# EAGLE design MINI_SAM_TQFP_2.54_BB_2017_01_12_001 (EAGLE 7.6.0)
DESIGNER: BENJAMIN SHOCKLEY; REV: A
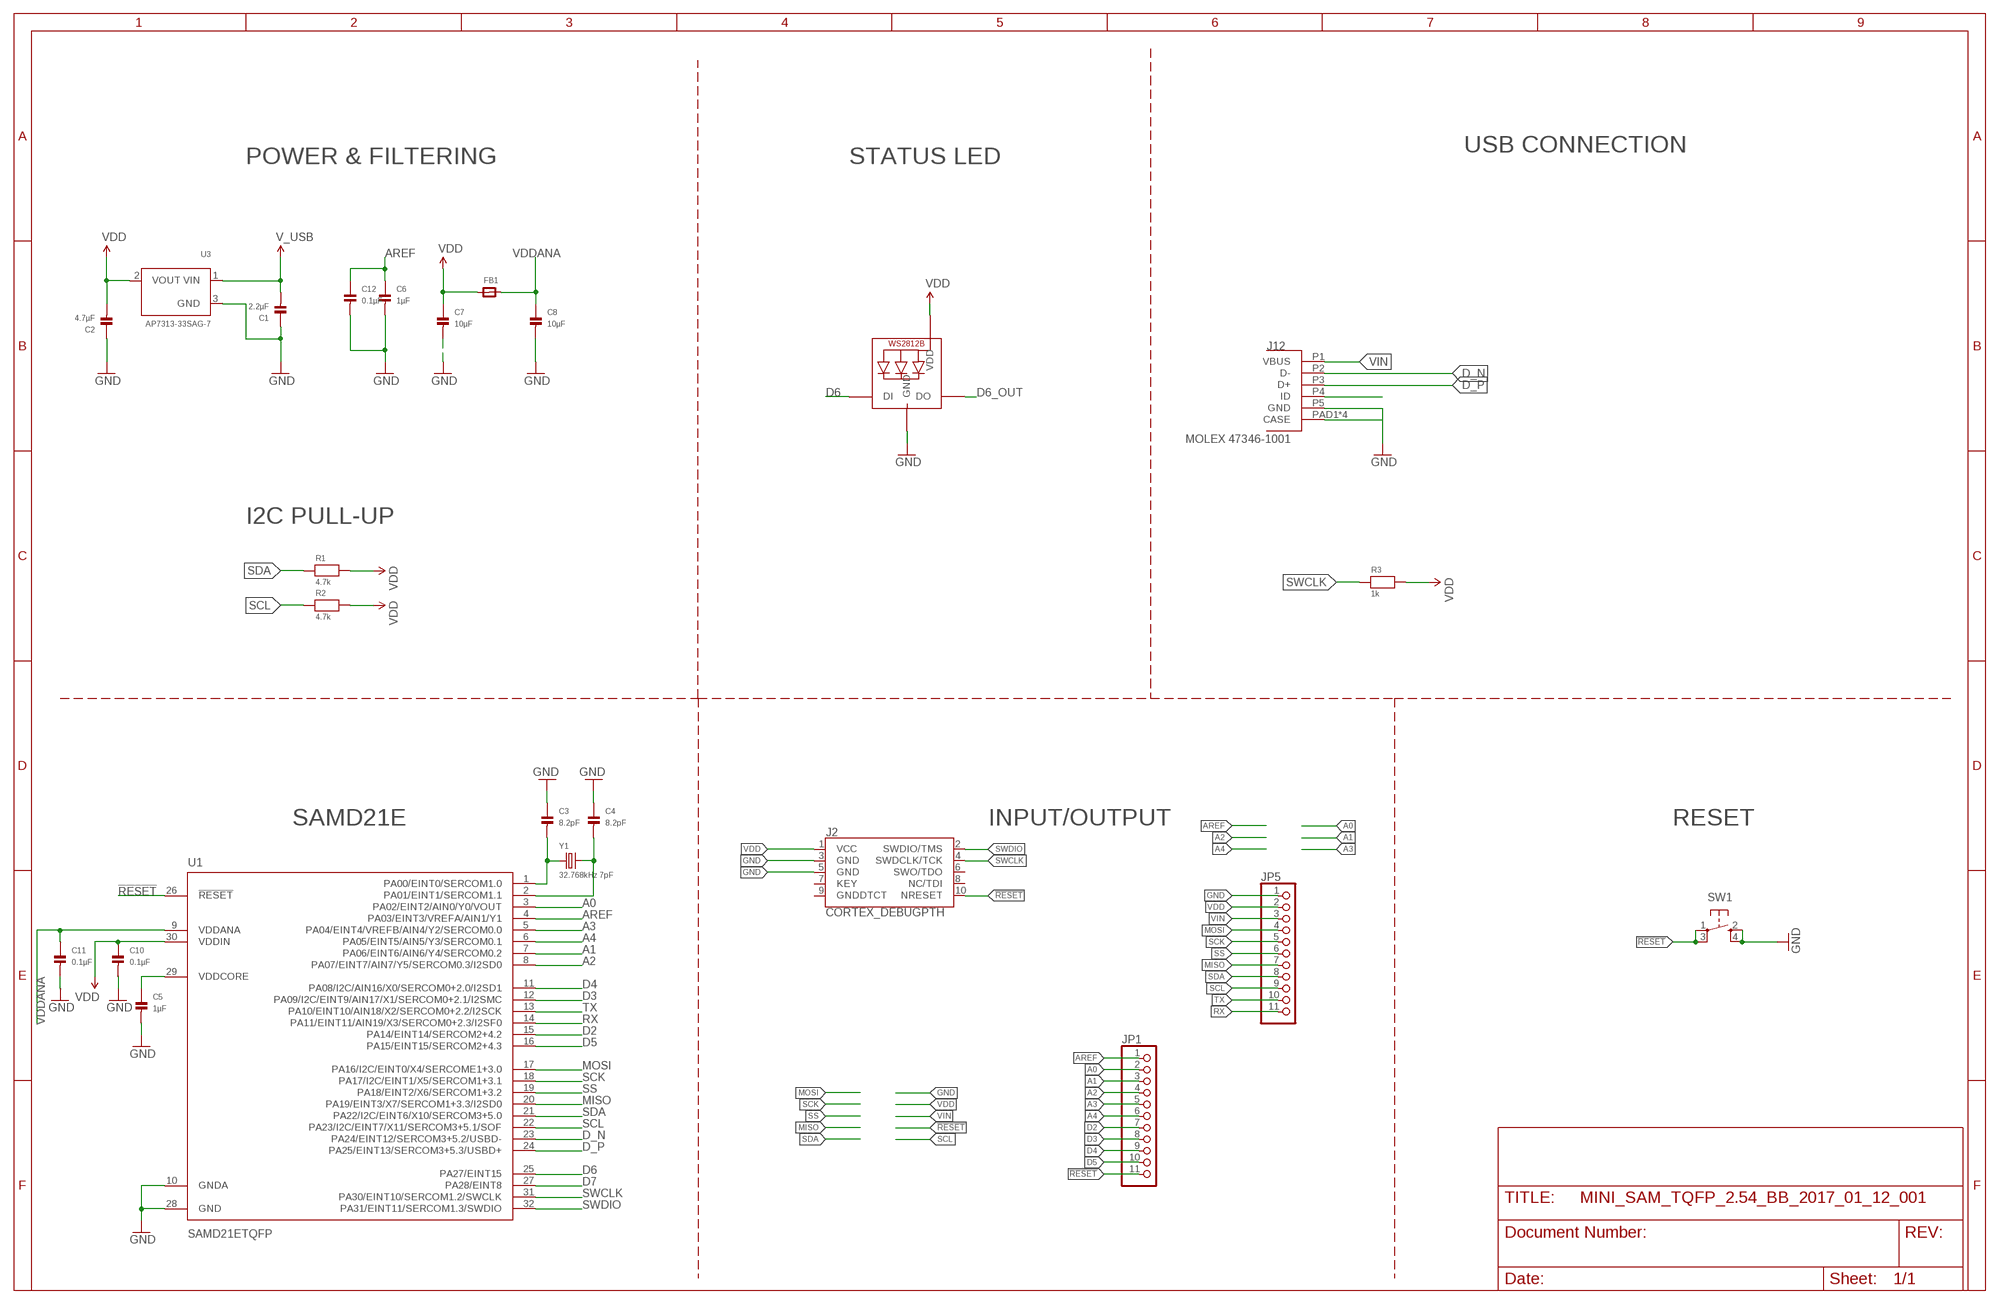
[diagram p0: schematic, sheet 1]

## Parts
C1  2.2µF  CAP_CERAMIC_0805MP  [_0805MP]
C2  4.7µF  CAP_CERAMIC_0805MP  [_0805MP]
C3  8.2pF  CAP_CERAMIC_0805MP  [_0805MP]
C4  8.2pF  CAP_CERAMIC_0805MP  [_0805MP]
C5  1µF  CAP_CERAMIC_0805MP  [_0805MP]
C6  1µF  CAP_CERAMIC_0805MP  [_0805MP]
C7  10µF  CAP_CERAMIC_0805MP  [_0805MP]
C8  10µF  CAP_CERAMIC_0805MP  [_0805MP]
C10  0.1µF  CAP_CERAMIC_0805MP  [_0805MP]
C11  0.1µF  CAP_CERAMIC_0805MP  [_0805MP]
C12  0.1µF  CAP_CERAMIC_0805MP  [_0805MP]
FB1  FERRITE_0805MP  [_0805MP]
J2  CORTEX_DEBUGPTH  [2X5-PTH-1.27MM]
J12  MOLEX_47346-100147346  [MOLEX_47346-1001]
JP1  PINHD-1X111X11_SMT  [1X11_SMT]
JP5  PINHD-1X111X11_SMT  [1X11_SMT]
R1  4.7k  RESISTOR_0805MP  [_0805MP]
R2  4.7k  RESISTOR_0805MP  [_0805MP]
R3  1k  RESISTOR_0805MP  [_0805MP]
STATUS  WS2812B3535  [LED3535]
SW1  SPST_TACT-KMR2  [KMR2]
U1  SAMD21ETQFP  [TQFP32-08]
U3  AP7313-33SAG-7  VREG_SOT23  [SOT23-R]
Y1  32.768kHz 7pF  CRYSTAL0805PACKAGE  [_0805MP]

## Nets
!RESET: J2.10(NRESET) JP1.11 SW1.1(P) SW1.3(P1) U1.26(!RESET)
A0: JP1.2 U1.3(PA02/EINT2/AIN0/Y0/VOUT)
A1: JP1.3 U1.7(PA06/EINT6/AIN6/Y4/SERCOM0.2)
A2: JP1.4 U1.8(PA07/EINT7/AIN7/Y5/SERCOM0.3/I2SD0)
A3: JP1.5 U1.5(PA04/EINT4/VREFB/AIN4/Y2/SERCOM0.0)
A4: JP1.6 U1.6(PA05/EINT5/AIN5/Y3/SERCOM0.1)
AREF: C6.1 C12.1 JP1.1 U1.4(PA03/EINT3/VREFA/AIN1/Y1)
D2: JP1.7 U1.15(PA14/EINT14/SERCOM2+4.2)
D3: JP1.8 U1.12(PA09/I2C/EINT9/AIN17/X1/SERCOM0+2.1/I2SMC)
D4: JP1.9 U1.11(PA08/I2C/AIN16/X0/SERCOM0+2.0/I2SD1)
D5: JP1.10 U1.16(PA15/EINT15/SERCOM2+4.3)
D6: STATUS.1(DI) U1.25(PA27/EINT15)
D6_OUT: STATUS.3(DO)
D7: U1.27(PA28/EINT8)
D_N [USB_DATA]: J12.P2(D-) U1.23(PA24/EINT12/SERCOM3+5.2/USBD-)
D_P [USB_DATA]: J12.P3(D+) U1.24(PA25/EINT13/SERCOM3+5.3/USBD+)
GND: C1.1 C2.1 C3.1 C4.1 C5.2 C6.2 C7.2 C8.2 C10.2 C11.2 C12.2 J2.3(GND) J2.5(GND) J12.P5(GND) J12.PAD1(CASE) J12.PAD2(CASE) J12.PAD3(CASE) J12.PAD4(CASE) JP5.1 STATUS.4(GND) SW1.2(S) SW1.4(S1) U1.10(GNDA) U1.28(GND) U3.3(GND)
MISO: JP5.7 U1.20(PA19/EINT3/X7/SERCOM1+3.3/I2SD0)
MOSI: JP5.4 U1.17(PA16/I2C/EINT0/X4/SERCOME1+3.0)
N$1: C3.2 U1.1(PA00/EINT0/SERCOM1.0) Y1.1
N$5: C4.2 U1.2(PA01/EINT1/SERCOM1.1) Y1.2
N$9: C5.1 U1.29(VDDCORE)
N$10: J12.P4(ID)
RX: JP5.11 U1.14(PA11/EINT11/AIN19/X3/SERCOM0+2.3/I2SF0)
SCK: JP5.5 U1.18(PA17/I2C/EINT1/X5/SERCOM1+3.1)
SCL: JP5.9 R2.1 U1.22(PA23/I2C/EINT7/X11/SERCOM3+5.1/SOF)
SDA: JP5.8 R1.1 U1.21(PA22/I2C/EINT6/X10/SERCOM3+5.0)
SS: JP5.6 U1.19(PA18/EINT2/X6/SERCOM1+3.2)
SWCLK: J2.4(SWDCLK/TCK) R3.1 U1.31(PA30/EINT10/SERCOM1.2/SWCLK)
SWDIO: J2.2(SWDIO/TMS) U1.32(PA31/EINT11/SERCOM1.3/SWDIO)
TX: JP5.10 U1.13(PA10/EINT10/AIN18/X2/SERCOM0+2.2/I2SCK)
VDD: C2.2 C7.1 C10.1 FB1.1 J2.1(VCC) JP5.2 R1.2 R2.2 R3.2 STATUS.2(VDD) U1.30(VDDIN) U3.2(VOUT)
VDDANA: C8.1 C11.1 FB1.2 U1.9(VDDANA)
VIN: C1.2 J12.P1(VBUS) JP5.3 U3.1(VIN) ; supply symbol labelled V_USB
Unconnected: J2.6(SWO/TDO) J2.7(KEY) J2.8(NC/TDI) J2.9(GNDDTCT)

## Notes on the sheet
- USB CONNECTION
- POWER & FILTERING | STATUS LED
- MOLEX 47346-1001
- I2C PULL-UP
- SAMD21E | INPUT/OUTPUT | RESET

## Library data of the parts
C1-C8 C10-C12 = microbuilder:CAP_CERAMIC: Ceramic Capacitors 0402 - 0402 Surface Mount Capacitors 16pF 50V 5% [Digikey: 445-4899-2-ND] 18pF 50V 5% [Digikey: 490-1281-2-ND] 22pF 50V 5% [Digikey: 490-1283-2-ND] 68pF 50V 5% [Digikey: 490-1289-2-ND] 0.1uF 10V 10% [Digikey: 490-1318-2-ND] 1.0uF 6.3V 10% [Digikey: 490-1320-2-ND] 0603 - 0603 Surface Mount Capacitors 16 pF 50V 5% [Digikey: 445-5051-2-ND] 22 pF 50V [Digikey: PCC220ACVTR-ND] 33 pF 50V 5% [Digikey: 490-1415-1-ND] 56pF 50V 5% [Digikey: 490-1421-1-ND] 220pF 50V 5% [Digikey: 445-1285-1-ND] 680 pF 50V 2200 pF 50V 5% C0G [Digikey: 445-1297-1-ND] 5600 pF 100V 5% X7R [Digikey: 478-3711-1-ND] 0.1 µF 25V 10% [Digikey: PCC2277TR-ND] 0.22 µF 16V 10% X7R [Digikey: 445-1318-1-ND] 1.0 µF 25V 10% [Digikey: 445-5146-2-ND] 0603 - RF Specific 3pF 250V +/-0.1pF RF [Digikey: 712-1347-1-ND] 18 pF 250V 5% [Digikey: 478-3505-1-ND or 712-1322-1-ND] 56 pF 250V 5% C0G RF [Digikey: 490-4867-1-ND] 68 pF 250V RF [Digikey: 490-4868-1-ND] 0805 - 0805 Surface Mount Capacitors 220 pF 250V 2% RF Ceramic Capacitor [Digikey: 712-1398-1-ND] 1000 pF 50V 2% NP0 Ceramic Capacitor [Digikey: 478-3760-1-ND] 0.1 µF 25V 10% Ceramic Capacitor [Digikey: PCC1828TR-ND] 1.0 µF 16V 10% Ceramic Capacitor[Digikey: 490-1691-2-ND] 10.0 µF 10V 10% Ceramic Capacitor[Digikey: 709-1228-1-ND] 10.0 uF 16V 10% Ceramic Capacitor [Digikey: 478-5165-2-ND] 47 uF 6.3V 20% Ceramic Capacitor [Digikey: 587-1779-1-ND or 399-5506-1-ND] 1206 - 1206 Surface Mount Capacitors 47uF 10V 20% Ceramic Capacitor [Digikey: 490-5528-1-ND or 399-5508-1-ND or 445-6010-1-ND] 100uF 6.3V -20%, +80% Y5V Ceramic Capacitor (Digikey: 490-4512-1-ND, Mouser: 81-GRM31CF50J107ZE1L)
FB1 = microbuilder:FERRITE: Ferrite Bead 0603 MMZ1608B121C - 120 Ohm @ 100MHz, 600mA, 0.15 Ohm DC Resistance - Digikey: 445-2164-1-ND BK1608HW121-T - 120 Ohm, 600mA Ferrite Chip - Digikey: 587-1876-2-ND 0805 HZ0805B272R-10 - 2.7K Ohm @ 100MHz, 200mA, 0.8 Ohm DC Resistance - Digikey: 240-2504-1-ND (see also Murata BLM21BD272SN1L) MMZ2012Y152B - 1.5K Ohm @ 100MHz, 500mA, 0.4 Ohm DC Resistance - Digikey: 445-1560-1-ND - Mainly for high frequency (80-400MHz) MMZ2012R102A - 1K Ohm @ 100MHz, 500mA, 0.3 Ohm DC Resistance - Digikey: 445-1555-2-ND - More general purpose (10-200MHz)
J2 = SparkFun-Connectors:CORTEX_DEBUG: Cortex Debug Connector Datasheet <http://infocenter.arm.com/help/topic/com.arm.doc.faqs/attached/13634/cortex_debug_connectors.pdf>
J12 = Shockley_Custom:MOLEX_47346-1001
JP1 JP5 = pinhead+:PINHD-1X11: PIN HEADER
R1-R3 = microbuilder:RESISTOR: Resistors 0402 - 0402 Surface Mount Package 22 Ohm 1% 1/16W [Digikey: 311-22.0LRTR-ND] 33 Ohm 5% 1/16W 1.0K 5% 1/16W 1.5K 5% 1/16W 2.0K 1% 1/16W 10.0K 1% 1/16W [Digikey: 311-10.0KLRTR-ND] 10.0K 5% 1/16W [Digikey: RMCF0402JT10K0TR-ND] 12.1K 1% 1/16W [Digikey: 311-22.0LRTR-ND] 100.0K 5% 1/16W 0603 - 0603 Surface Mount Package 0 Ohm 1/10 Watt 1% Resistor 15 Ohm 1/10 Watt 1% Resistor 33 Ohm 1/10 Watt 1% Resistor 49.9 Ohm 1/10 Watt 1% Resistor 100 Ohm 1/10 Watt 1% Resistor 150 Ohm 1/10 Watt 1% Resistor 240 Ohm 1/10 Watt 1% Resistor 390 Ohm 1/10 Watt 1% Resistor 560 Ohm 1/10 Watt 1% Resistor 680 Ohm 1/10 Watt 1% Resistor 750 Ohm 1/10 Watt 1% Resistor 1.0K Ohm 1/10 Watt 1% Resistor 1.5K Ohm 1/10 Watt 1% Resistor 2.0K Ohm 1/10 Watt 1% Resistor 2.2K Ohm 1/10 Watt 1% Resistor 3.3K Ohm 1/10 Watt 1% Resistor 4.7K Ohm 1/10 Watt 1% Resistor 10.0K Ohm 1/10 Watt 1% Resistor 12.0K Ohm 1/10 Watt 1% Resistor 12.1K Ohm 1/10 Watt 1% Resistor 20.0K Ohm 1/10 Watt 1% Resistor 33.0K Ohm 1/10 Watt 1% Resistor 100.0K Ohm 1/10 Watt 1% Resistor 0805 - 0805 Surface Mount Package 0 Ohm 1/8 Watt 1% Resistor 33 Ohm 1/8 Watt 1% Resistor 100 Ohm 1/8 Watt 1% Resistor 150 Ohm 1/8 Watt 1% Resistor 200 Ohm 1/8 Watt 1% Resistor 240 Ohm 1/8 Watt 1% Resistor 330 Ohm 1/8 Watt 1% Resistor 390 Ohm 1/8 Watt 1% Resistor 470 Ohm 1/8 Watt 1% Resistor 1.0K Ohm 1/8 Watt 1% Resistor 1.5K Ohm 1/8 Watt 1% Resistor 2.0K Ohm 1/8 Watt 1% Resistor 4.7K Ohm 1/8 Watt 1% Resistor 5.1K Ohm 1/8 Watt 1% Resistor 5.6K Ohm 1/8 Watt 1% Resistor 10.0K Ohm 1/8 Watt 1% Resistor 22.0K Ohm 1/8 Watt 1% Resistor 33.0K Ohm 1/8 Watt 1% Resistor 100K Ohm 1/8 Watt 1% Resistor 1206 - 1206 Surface Mount Package 2012 - 2010 Surface Mount Package 0.11 Ohm 1/2 Watt 1% Resistor - Digikey: RHM.11UCT-ND
STATUS = adafruit:WS2812B
SW1 = adafruit:SPST_TACT: SMT 6mm switch, EVQQ2 series http://www.ladyada.net/library/eagle
U1 = Shockley_Custom:SAMD21E
U3 = microbuilder:VREG_SOT23: SOT23 Fixed Voltage Regulators Part Current Out V Out V In V Dropout Digikey Part No. AP7313 150mA 3.3V 3.5-6V 0.15V @ 150mA AP7313-33SAG-7DICT-ND
Y1 = Shockley_Custom:CRYSTAL: Crystals HC49UP - Surface Mount Crystal 4.0MHz 18pF +/-30ppm Surface Mount Crystal [Digikey: 535-9857-1-ND] 12.0 MHz Surface Mount Crystal [Digikey: 535-9869-6-ND] 25.0 MHz Surface Mount Crystal [Digikey: 535-9078-1-ND] 2.5 x 2.0mm - MEMs SMT Crystal 16.0 MHz 10pF 20ppm 2.5 x 2.0mm Crystal [Digikey -40-85°C: 535-10923-1-ND] 3.2 x 2.5mm - MEMs SMT Crystal 12.0 MHz 8pF 15ppm 3.2 x 2.5mm Crystal [Digikey: -10-70°C: 644-1047-1-ND -40-125°C: 644-1128-1-ND] 16.0 MHz 8pF 15ppm 3.2 x 2.5mm Crystal [Digikey: -10-70°C: 644-1049-1-ND -40-125°C: 644-1129-2-ND] 16.0 MHz 10pF 10ppm 3.2 x 2.5mm Crystal [Digikey: 644-1100-1-ND] 27.12 MHz 18pF 30ppm 3.2 x 2.5mm Crystal [Digikey: 887-1424-1-ND] 27.12MHz 10pF 10ppm 3.2 x 2.5mm Crystal [Digikey: 887-1329-1-ND] 4.9 x 1.8mm - MEMs SMT Crystal 32.768 KHz 12.5pF 20ppm 4.9 x 1.8mm Crystal [Digikey: SE2415CT-ND] 8.0 x 3.8mm - Surface Mount Crystal 32.768kHz 12.5pF 20ppm -40°C-85°C [Digikey: 535-9166-2-ND] Cylinder 32.768KHz Cylinder Crystal (2x6mm body) [Ex. Digikey: 300-8341-2-ND]

## Board
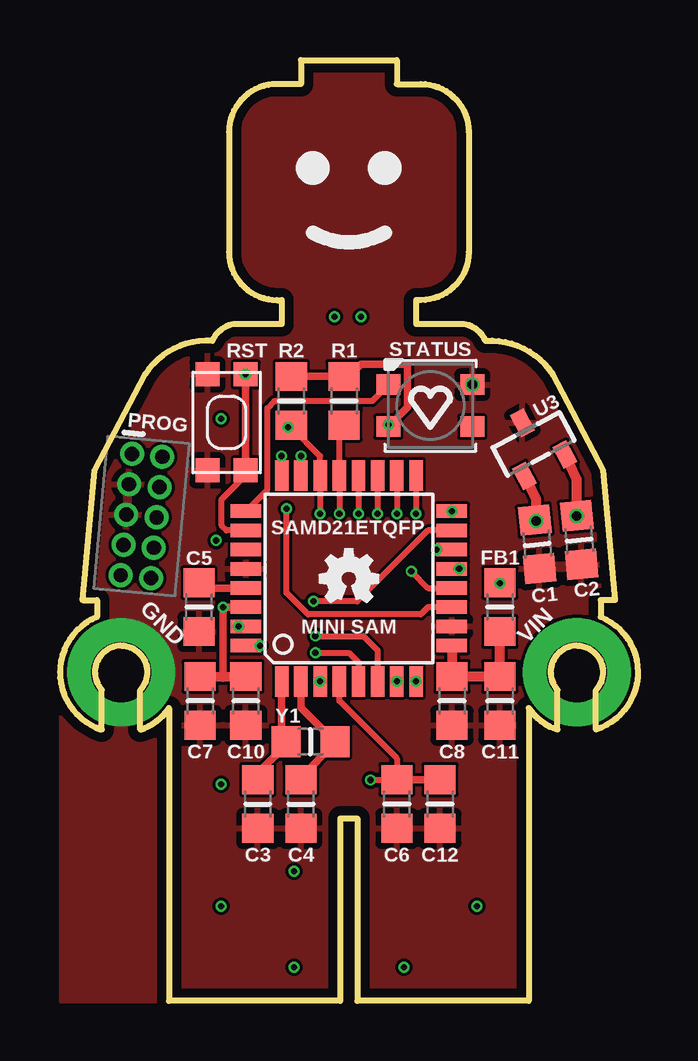
[diagram p1: board, top side]
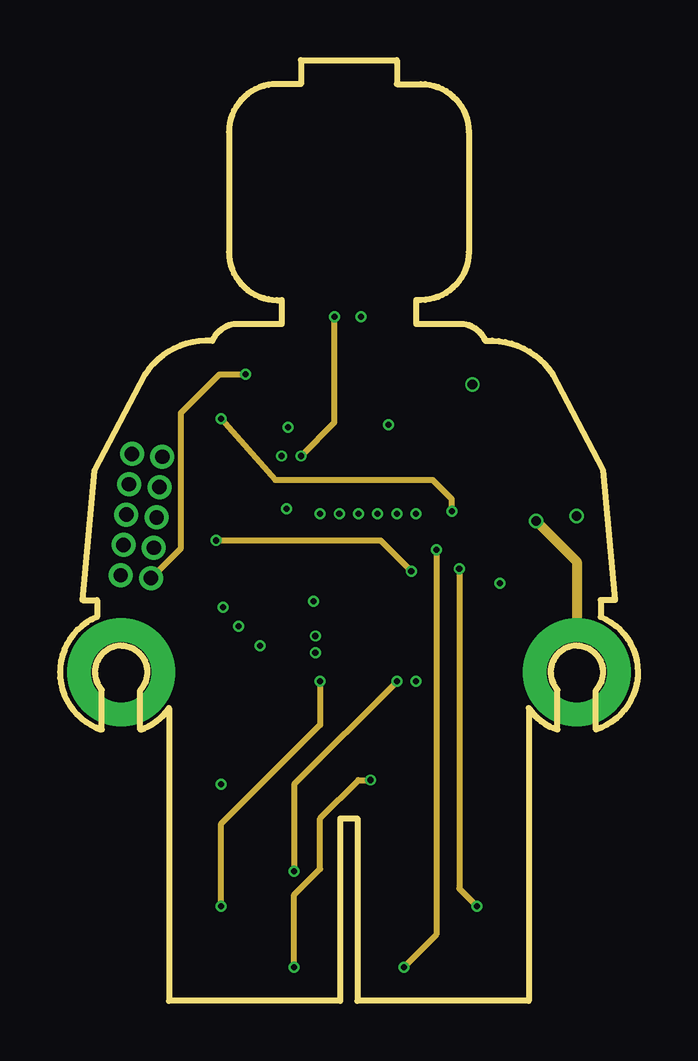
[diagram p2: board, inner layer Route2]
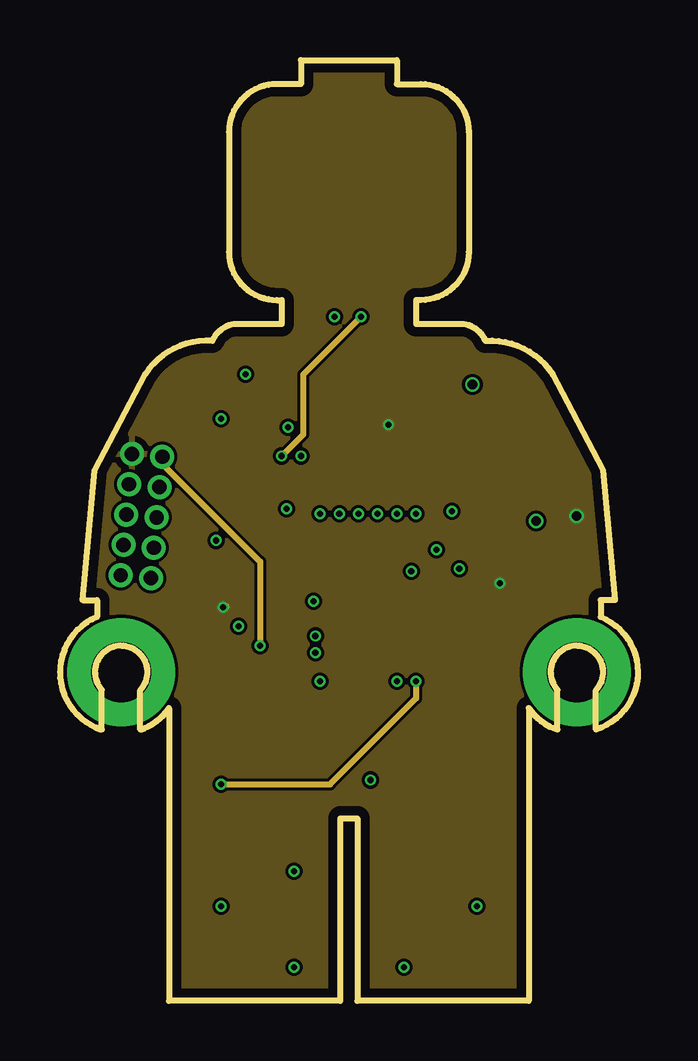
[diagram p3: board, inner layer Route15]
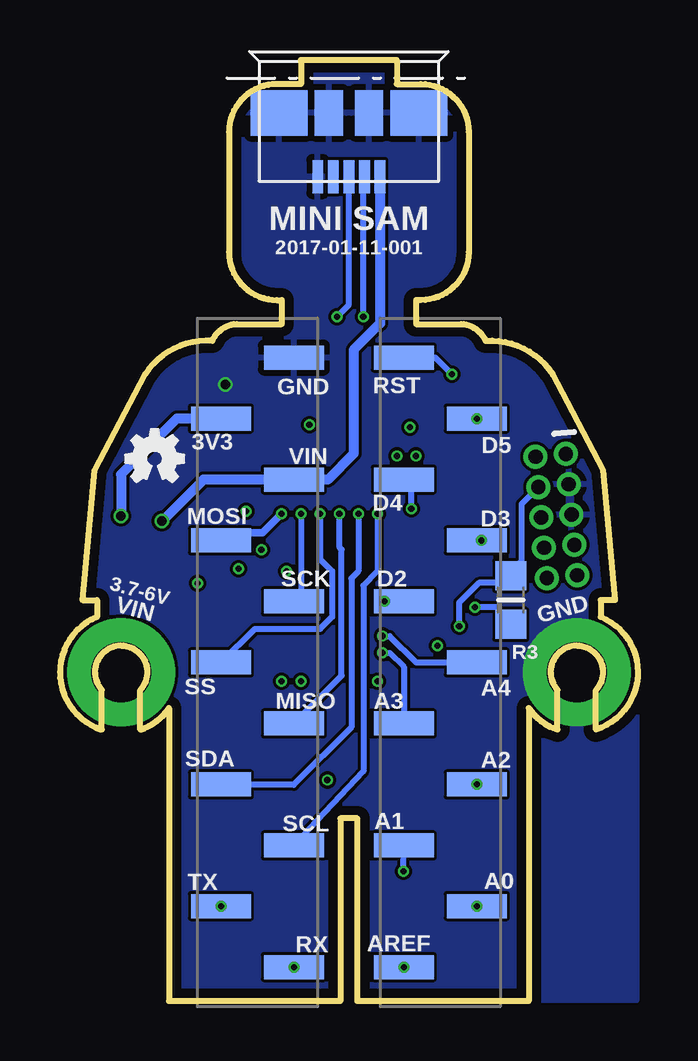
[diagram p4: board, bottom side, seen from below]

Size 24.1 x 39.2 mm. Coordinates in mm from the lower left corner, seen from the top.
Outline: 4.55,12.2 4.55,0 11.7,0 11.7,7.6 12.4,7.6 12.4,0 19.55,0 19.55,12.2
Outline: 4.55,12.2 arc-28 3.65,11.4
Outline: 4.55,12.2 arc-40 3.35,11.3 3.35,12.95 arc132 2.55,14.8 arc132 1.75,12.95 1.75,11.3 arc-140 1.55,16 1.55,16.7 0.95,16.7 1.45,22.1 3.55,26.1 arc-60 6.35,27.5 arc-63 7.37,28.2 9.25,28.2 9.25,29.2 9.05,29.2 arc-90 7.05,31.2 7.05,36.2 arc-90 9.05,38.2 10.05,38.2 10.05,39.2 14.05,39.2 14.05,38.2 15.05,38.2 arc-90 17.05,36.2 17.05,31.2 arc-90 15.05,29.2 14.85,29.2 14.85,28.2 16.73,28.2 arc-63 17.75,27.5 arc-60 20.55,26.1 22.65,22.1 23.15,16.7 22.55,16.7 22.55,16 arc-140 22.35,11.3 22.35,12.95 arc132 21.55,14.8 arc132 20.75,12.95 20.75,11.3 arc-40 19.55,12.2
Outline: 19.55,12.2 arc28 20.45,11.4
Copper layers (1*2*15*16): Top 0.035559375mm / dielectric 0.17018125mm / Route2 0.01778125mm / dielectric 47mil / Route15 0.01778125mm / dielectric 0.17018125mm / Bottom 0.035559375mm
Design rules "OSHPark-4layer *": minimum track width 5mil, minimum drill 10mil, track to track 5mil, track to pad 5mil, pad to pad 5mil, via to via 5mil, smd to smd 5mil, copper to edge 15mil, drill to drill 6mil, minimum pad ring 4mil, minimum via ring 4mil, stop-mask expansion 2.5mil, vias tented up to drill 28mil, thermal gap 10mil

### Footprints (pad centres in the part's own frame; a part is rotated, then mirrored left to right if it is on the bottom)
_0805MP = smd 1.2 x 1.3: 1 -1.016,0; 2 1.016,0
2X5-PTH-1.27MM = drill 0.6 pad 1: 1 -2.54,-0.635; 2 -2.54,0.635; 3 -1.27,-0.635; 4 -1.27,0.635; 5 0,-0.635; 6 0,0.635; 7 1.27,-0.635; 8 1.27,0.635; 9 2.54,-0.635; 10 2.54,0.635
MOLEX_47346-1001 = smd 0.45 x 1.38: P1 1.3,-2.66; P2 0.65,-2.66; P3 0,-2.66; P4 -0.65,-2.66; P5 -1.3,-2.66 | smd 2.375 x 1.9: PAD1 -2.913,0; PAD4 2.913,0 | smd 1.175 x 1.9: PAD2 -0.838,0; PAD3 0.838,0
1X11_SMT = smd 1 x 2.5: 1 -12.7,1.52; 2 -10.16,-1.52; 3 -7.62,1.52; 4 -5.08,-1.52; 5 -2.54,1.52; 6 0,-1.52; 7 2.54,1.52; 8 5.08,-1.52; 9 7.62,1.52; 10 10.16,-1.52; 11 12.7,1.52
LED3535 = smd 1 x 0.85: 1 -1.75,0.875; 2 -1.75,-0.875; 3 1.75,-0.875; 4 1.75,0.875
KMR2 = smd 1 x 1: 1 2,0.8; 2 2,-0.8; 3 -2,0.8; 4 -2,-0.8
TQFP32-08 = smd 1.27 x 0.559: 1 -4.293,2.8; 2 -4.293,2; 3 -4.293,1.2; 4 -4.293,0.4; 5 -4.293,-0.4; 6 -4.293,-1.2; 7 -4.293,-2; 8 -4.293,-2.8; 17 4.293,-2.8; 18 4.293,-2; 19 4.293,-1.2; 20 4.293,-0.4; 21 4.293,0.4; 22 4.293,1.2; 23 4.293,2; 24 4.293,2.8 | smd 0.559 x 1.27: 9 -2.8,-4.293; 10 -2,-4.293; 11 -1.2,-4.293; 12 -0.4,-4.293; 13 0.4,-4.293; 14 1.2,-4.293; 15 2,-4.293; 16 2.8,-4.293; 25 2.8,4.293; 26 2,4.293; 27 1.2,4.293; 28 0.4,4.293; 29 -0.4,4.293; 30 -1.2,4.293; 31 -2,4.293; 32 -2.8,4.293
SOT23-R = smd 0.635 x 1.016: 1 -0.95,-1; 2 0.95,-1; 3 0,1

### Placement (x,y rotation side)
C1  19.9,19.02 95.7 top
C2  21.65,19.2 95.7 top
C3  8.25,8.2 90 top
C4  10.05,8.2 90 top
C5  5.8,16.4 270 top
C6  14.05,8.2 270 top
C7  5.85,12.5 270 top
C8  16.35,12.5 270 top
C10  7.75,12.5 270 top
C11  18.35,12.5 270 top
C12  15.85,8.2 270 top
FB1  18.35,16.4 270 top
J2  3.4,20.2 264.7 top
J12  12.05,37 0 bottom
JP1  8.24,14.1 90 bottom
JP5  15.86,14.1 270 bottom
R1  11.85,25 90 top
R2  9.65,25 90 top
R3  5.3,16.7 270 bottom
STATUS  15.45,24.8 0 top
SW1  6.95,24.1 270 top
U1  12.05,17.6 90 top
U3  19.75,23.2 27.7 top
U$1  [OSHW-LOGO-MINI]  12.05,17.6 0 top
U$2  [OSHW-LOGO-MINI]  20.15,22.6 0 bottom
Y1  10.45,10.8 0 top

### Tracks (layer width: path | path; a pad name or v marks a point on that pad's centre or on a via)
!RESET  (via drill 0.25)
  Top 0.254: U1.26 6.95,19.6 6.75,19.8 6.75,20.9 7.75,21.9 SW1.1
  Top 0.305: SW1.1 SW1.3
  Route2 0.254: J2.10 5.05,18.86 5.05,24.5 6.65,26.1 SW1.3
  Bottom 0.254: 9.35,26.8 JP1.11 8.45,26.8 SW1.3
  other vias: 7.75,26.1
A0  (via drill 0.25)
  Route2 0.254: U1.3 10.85,11.5 6.73,7.38 JP1.2
  other vias: 10.85,13.31 6.72,3.94
A1  (via drill 0.25)
  Route2 0.254: U1.7 9.77,9.02 v9.77,5.4
  Bottom 0.254: v9.77,5.4 JP1.3
  other vias: 14.05,13.31
A2  (via drill 0.25)
  Route15 0.254: U1.8 14.85,12.6 11.27,9.02 JP1.4
  other vias: 14.85,13.31 6.72,9.02
A3  (via drill 0.25)
  Top 0.254: v10.65,14.5 12.05,14.5 12.45,14.1 U1.5
  Bottom 0.254: v10.65,14.5 10.35,14.5 9.76,13.91 JP1.5
A4  (via drill 0.25)
  Top 0.254: v10.65,15.2 12.65,15.2 13.25,14.6 U1.6
  Bottom 0.254: v10.65,15.2 10.35,15.2 9.25,14.1 JP1.6
AREF  (via drill 0.25)
  Top 0.254: U1.4 11.65,12.5 14.05,10.1 C6.1 13.06,9.22 v12.95,9.2
  Top 0.305: C6.1 C12.1
  Route2 0.254: JP1.1 9.77,4.42 10.85,5.5 10.85,7.6 12.45,9.2 v12.95,9.2
  other vias: 9.76,1.4
D2  (via drill 0.25)
  Top 0.254: U1.15 15.35,19.6 12.39,16.64 v10.57,16.64
  Bottom 0.254: JP1.7 v10.57,16.64
D3  (via drill 0.25)
  Top 0.254: v14.65,17.9 15.35,17.2 U1.12
  Route2 0.254: v14.65,17.9 13.37,19.18 v6.52,19.18
  Bottom 0.254: v6.52,19.18 JP1.8
D4  (via drill 0.25)
  Top 0.254: U1.11 15.35,16.4 15.05,16.1 10.35,16.1 9.45,17 v9.45,20.5
  Bottom 0.254: v9.45,20.5 9.45,21.7 JP1.9
D5  (via drill 0.25)
  Route2 0.254: U1.16 16.34,20.91 15.55,21.7 8.99,21.7 JP1.10
  other vias: 16.34,20.4 6.72,24.26
D6
  Top 0.254: U1.25 8.65,21.3 8.65,24.7 8.95,25 13.02,25 STATUS.1
  Top 0.305: U1.25
D_N  (via drill 0.25)
  Top 0.254: U1.23 v10.05,22.7
  Route2 0.254: v10.05,22.7 11.45,24.1 v11.45,28.5
  Bottom 0.254: v11.45,28.5 11.45,34.29 J12.P2
D_P  (via drill 0.25)
  Top 0.254: U1.24 v9.25,22.7
  Route15 0.254: v9.25,22.7 10.15,23.6 10.15,26.1 v12.55,28.5
  Bottom 0.254: v12.55,28.5 12.05,29 J12.P3
GND  (via drill 0.4, 2.5 pad 4.5)
  other vias: 2.55,13.7 17.2,25.68
  pour Top: 0.05,0 24.05,0 24.05,39.2 0.05,39.2
  pour Bottom: 0.05,0 24.05,0 24.05,39.2 0.05,39.2
MISO  (via drill 0.25)
  Top 0.254: U1.20 v12.45,20.3
  Bottom 0.254: JP5.7 12.35,13.55 12.35,18.8 12.45,18.9 v12.45,20.3
MOSI  (via drill 0.25)
  Top 0.254: U1.17 v14.85,20.3
  Bottom 0.254: 16.47,19.18 16.95,19.18 JP5.4
  Bottom 0.305: v14.85,20.3 15.65,19.5 16.63,19.5 arc-90 16.95,19.18
N$1
  Top 0.254: 9.55,10.78 Y1.1 9.25,11.08 | 8.35,9.58 C3.2
  Top 0.305: 9.55,10.78 8.35,9.58 | U1.1 9.25,11.08
N$5
  Top 0.254: 10.35,9.58 C4.2
  Top 0.305: 10.35,9.58 Y1.2 10.05,12.22 U1.2
N$9
  Top 0.254: 6.01,17.2 C5.1
  Top 0.305: U1.29 6.01,17.2
RX  (via drill 0.25)
  Top 0.305: v15.7,18.8 U1.14
  Route2 0.254: v15.7,18.8 15.7,2.76 JP5.11
  other vias: 14.34,1.4
SCK  (via drill 0.25)
  Top 0.254: U1.18 v14.05,20.3
  Bottom 0.254: v14.05,20.3 14.05,17.12 JP5.5
SCL  (via drill 0.25)
  Top 0.254: v9.51,23.9 R2.1 9.65,23.9 10.85,22.7 U1.22 v10.85,20.3
  Bottom 0.254: v10.85,20.3 10.85,17.9 11.45,17.3 11.45,9.56 JP5.9
SDA  (via drill 0.25)
  Top 0.254: v11.65,20.3 U1.21 11.65,23.78 R1.1
  Bottom 0.254: 16.97,9.02 JP5.8 17.55,9 14.35,9 11.95,11.4 11.95,17.6 11.65,17.9 v11.65,20.3
SS  (via drill 0.25)
  Top 0.254: U1.19 v13.25,20.3
  Bottom 0.254: JP5.6 15.97,15.5 13.25,15.5 12.75,16 12.75,17.9 13.25,18.4 v13.25,20.3
SWCLK  (via drill 0.25)
  Top 0.254: U1.31 v7.45,15.6
  Bottom 0.254: v7.45,15.6 7.45,16.6 6.63,17.42 5.7,17.42 R3.1 4.85,18.37 4.85,20.7 J2.4
SWDIO  (via drill 0.25)
  Top 0.203: U1.32 v8.35,14.8
  Route15 0.254: J2.2 4.26,22.38 8.35,18.3 v8.35,14.8
TX  (via drill 0.25)
  Top 0.305: U1.13 v16.65,18
  Route2 0.254: v16.65,18 16.65,4.67 JP5.10
  other vias: 17.38,3.94
VDD  (via drill 0.25, 0.4)
  Top 0.254: 7.83,13.7 C10.1 | v18.35,17.4 FB1.1 | v21.55,20.2 C2.2 | 9.65,26.4 R2.2
  Top 0.305: 6.8,13.5 v6.8,16.4 U1.30 | R2.2 R1.2 12.05,26.02 12.56,26.52 14.5,26.52 14.5,24.73 STATUS.2 v13.7,24
  Top 0.406: C10.1 6.8,13.5 C7.1 | U3.2 21.55,21.7 C2.2
  Route15 0.406: v6.8,16.4 6.85,16.4
  Bottom 0.254: 6.8,16.38 v6.8,16.4 5.91,16.4 R3.2
  Bottom 0.406: JP5.2 19.22,24.26 21.55,21.93 v21.55,20.2
  pour Route15 (rank 3): 0.05,0 24.05,0 24.05,40 0.05,40
VDDANA
  Top 0.254: C8.1
  Top 0.406: C8.1 C11.1 FB1.2 | U1.9 C8.1
VIN  (via drill 0.4, 2.5 pad 4.5)
  Top 0.254: 19.85,20.08 C1.2 19.83,20 v19.85,20
  Top 0.305: U3.1 19.75,21.1
  Top 0.406: U3.1 19.85,20.9 19.85,20.08
  Route2 0.406: v19.85,20 21.55,18.3 v21.55,13.7
  Bottom 0.406: J12.P1 10.75,28.22 11.85,27.12 11.85,22.8 12.93,21.72 JP5.3 18.11,21.72 C1.2 19.82,20.03 v19.85,20

### Text on the board
tPlace: GND | VIN
tNames: RST | PROG | MINI SAM
bNames: MINI SAM | 2017-01-11-001 | RST | GND | D5 | VIN | 3V3 | D4 | D3 | MOSI | D2 | SCK | 3.7-6V | GND | VIN | A4 | A3 | SS | MISO | A2 | SDA | A1 | SCL | A0 | TX | AREF | RX